# Altium project Panel_10_100_Pasive.PrjPCB
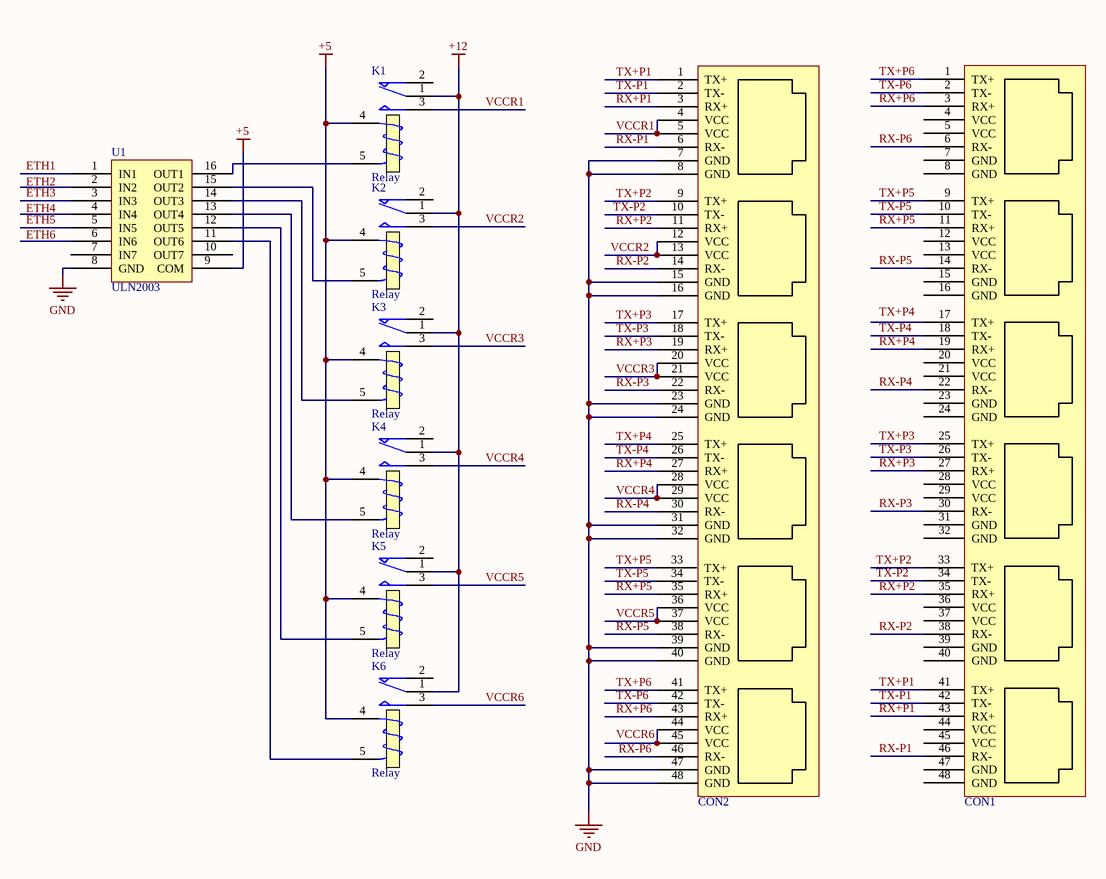
[diagram p0: Panel_10_100_Pasive_Schematic.SchDoc]
1 sheet, 9 parts. Net scope: global (net labels, ports and power ports of the same name join across sheets).
Board file: Panel_10_100_Pasive_PCB.PcbDoc

## Sheet Panel_10_100_Pasive_Schematic.SchDoc
size A3

### Parts
CON1  RJ45-w57-6  [RJ45-W57-6]  (value not drawn)
CON2  RJ45-w57-6  [RJ45-W57-6]  (value not drawn)
K1  Relay  [Relay 15.40x12.10x13.10]
K2  Relay  [Relay 15.40x12.10x13.10]
K3  Relay  [Relay 15.40x12.10x13.10]
K4  Relay  [Relay 15.40x12.10x13.10]
K5  Relay  [Relay 15.40x12.10x13.10]
K6  Relay  [Relay 15.40x12.10x13.10]
U1  ULN2003  [SOCI16]

### Nets
+5: K1.4(T1) K2.4(T1) K3.4(T1) K4.4(T1) K5.4(T1) K6.4(T1) U1.9(COM)
+12: K1.1(COM) K2.1(COM) K3.1(COM) K4.1(COM) K5.1(COM) K6.1(COM)
GND: CON2.7(GND) CON2.8(GND) CON2.15(GND) CON2.16(GND) CON2.23(GND) CON2.24(GND) CON2.31(GND) CON2.32(GND) CON2.39(GND) CON2.40(GND) CON2.47(GND) CON2.48(GND) U1.8(GND)
ETH1: U1.1(IN1)
ETH3: U1.3(IN3)
ETH5: U1.5(IN5)
RX+P1: CON1.43(RX+) CON2.3(RX+)
RX+P2: CON1.35(RX+) CON2.11(RX+)
RX+P3: CON1.27(RX+) CON2.19(RX+)
RX+P4: CON1.19(RX+) CON2.27(RX+)
RX+P5: CON1.11(RX+) CON2.35(RX+)
RX+P6: CON1.3(RX+) CON2.43(RX+)
RX-P1: CON1.46(RX-) CON2.6(RX-)
RX-P2: CON1.38(RX-) CON2.14(RX-)
RX-P3: CON1.30(RX-) CON2.22(RX-)
RX-P4: CON1.22(RX-) CON2.30(RX-)
RX-P5: CON1.14(RX-) CON2.38(RX-)
RX-P6: CON1.6(RX-) CON2.46(RX-)
TX+P1: CON1.41(TX+) CON2.1(TX+)
TX+P2: CON1.33(TX+) CON2.9(TX+)
TX+P3: CON1.25(TX+) CON2.17(TX+)
TX+P4: CON2.25(TX+)
TX+P5: CON1.9(TX+) CON2.33(TX+)
TX+P6: CON1.1(TX+) CON2.41(TX+)
TX-P1: CON1.42(TX-) CON2.2(TX-)
TX-P2: CON1.34(TX-) CON2.10(TX-)
TX-P3: CON1.26(TX-) CON2.18(TX-)
TX-P4: CON1.18(TX-) CON2.26(TX-)
TX-P5: CON1.10(TX-) CON2.34(TX-)
TX-P6: CON1.2(TX-) CON2.42(TX-)
VCCR1: CON2.4(VCC) CON2.5(VCC) K1.3(NO)
VCCR2: CON2.12(VCC) CON2.13(VCC) K2.3(NO)
VCCR3: CON2.20(VCC) CON2.21(VCC) K3.3(NO)
VCCR4: CON2.28(VCC) CON2.29(VCC) K4.3(NO)
VCCR5: CON2.36(VCC) CON2.37(VCC) K5.3(NO)
VCCR6: K6.3(NO)
NetCON2_44: CON2.44(VCC) CON2.45(VCC)
NetK1_5: K1.5(T2) U1.16(OUT1)
NetK2_5: K2.5(T2) U1.15(OUT2)
NetK3_5: K3.5(T2) U1.14(OUT3)
NetK4_5: K4.5(T2) U1.13(OUT4)
NetK5_5: K5.5(T2) U1.12(OUT5)
NetK6_5: K6.5(T2) U1.11(OUT6)

Not connected (* = marked no-connect by the designer): CON1 4(VCC) 5(VCC) 7(GND) 8(GND) 12(VCC) 13(VCC) 15(GND) 16(GND) 17(TX+) 20(VCC) 21(VCC) 23(GND) 24(GND) 28(VCC) 29(VCC) 31(GND) 32(GND) 36(VCC) 37(VCC) 39(GND) 40(GND) 44(VCC) 45(VCC) 47(GND) 48(GND); K1 2(NC); K2 2(NC); K3 2(NC); K4 2(NC); K5 2(NC); K6 2(NC); U1 2(IN2) 4(IN4) 6(IN6) 7(IN7) 10(OUT7)

### Notes on the sheet
- Labels drawn without touching a wire or pin: ETH2, ETH4, ETH6, TX+P4, VCCR6
- Title
- Size:
- Date:
- A3
- Number:
- Time:
- Revision:
- Sheet
- of
- File:

### Library data of the parts
K1-K6 = Relay: SPDT Relay; Designer: Eng. Saeid Jorablo; Company: E.P.I.L; Design_Date: 2011/10/31